# EAGLE design Grove - Barometer Sensor (BMP280) v1.0 (EAGLE 6.4)
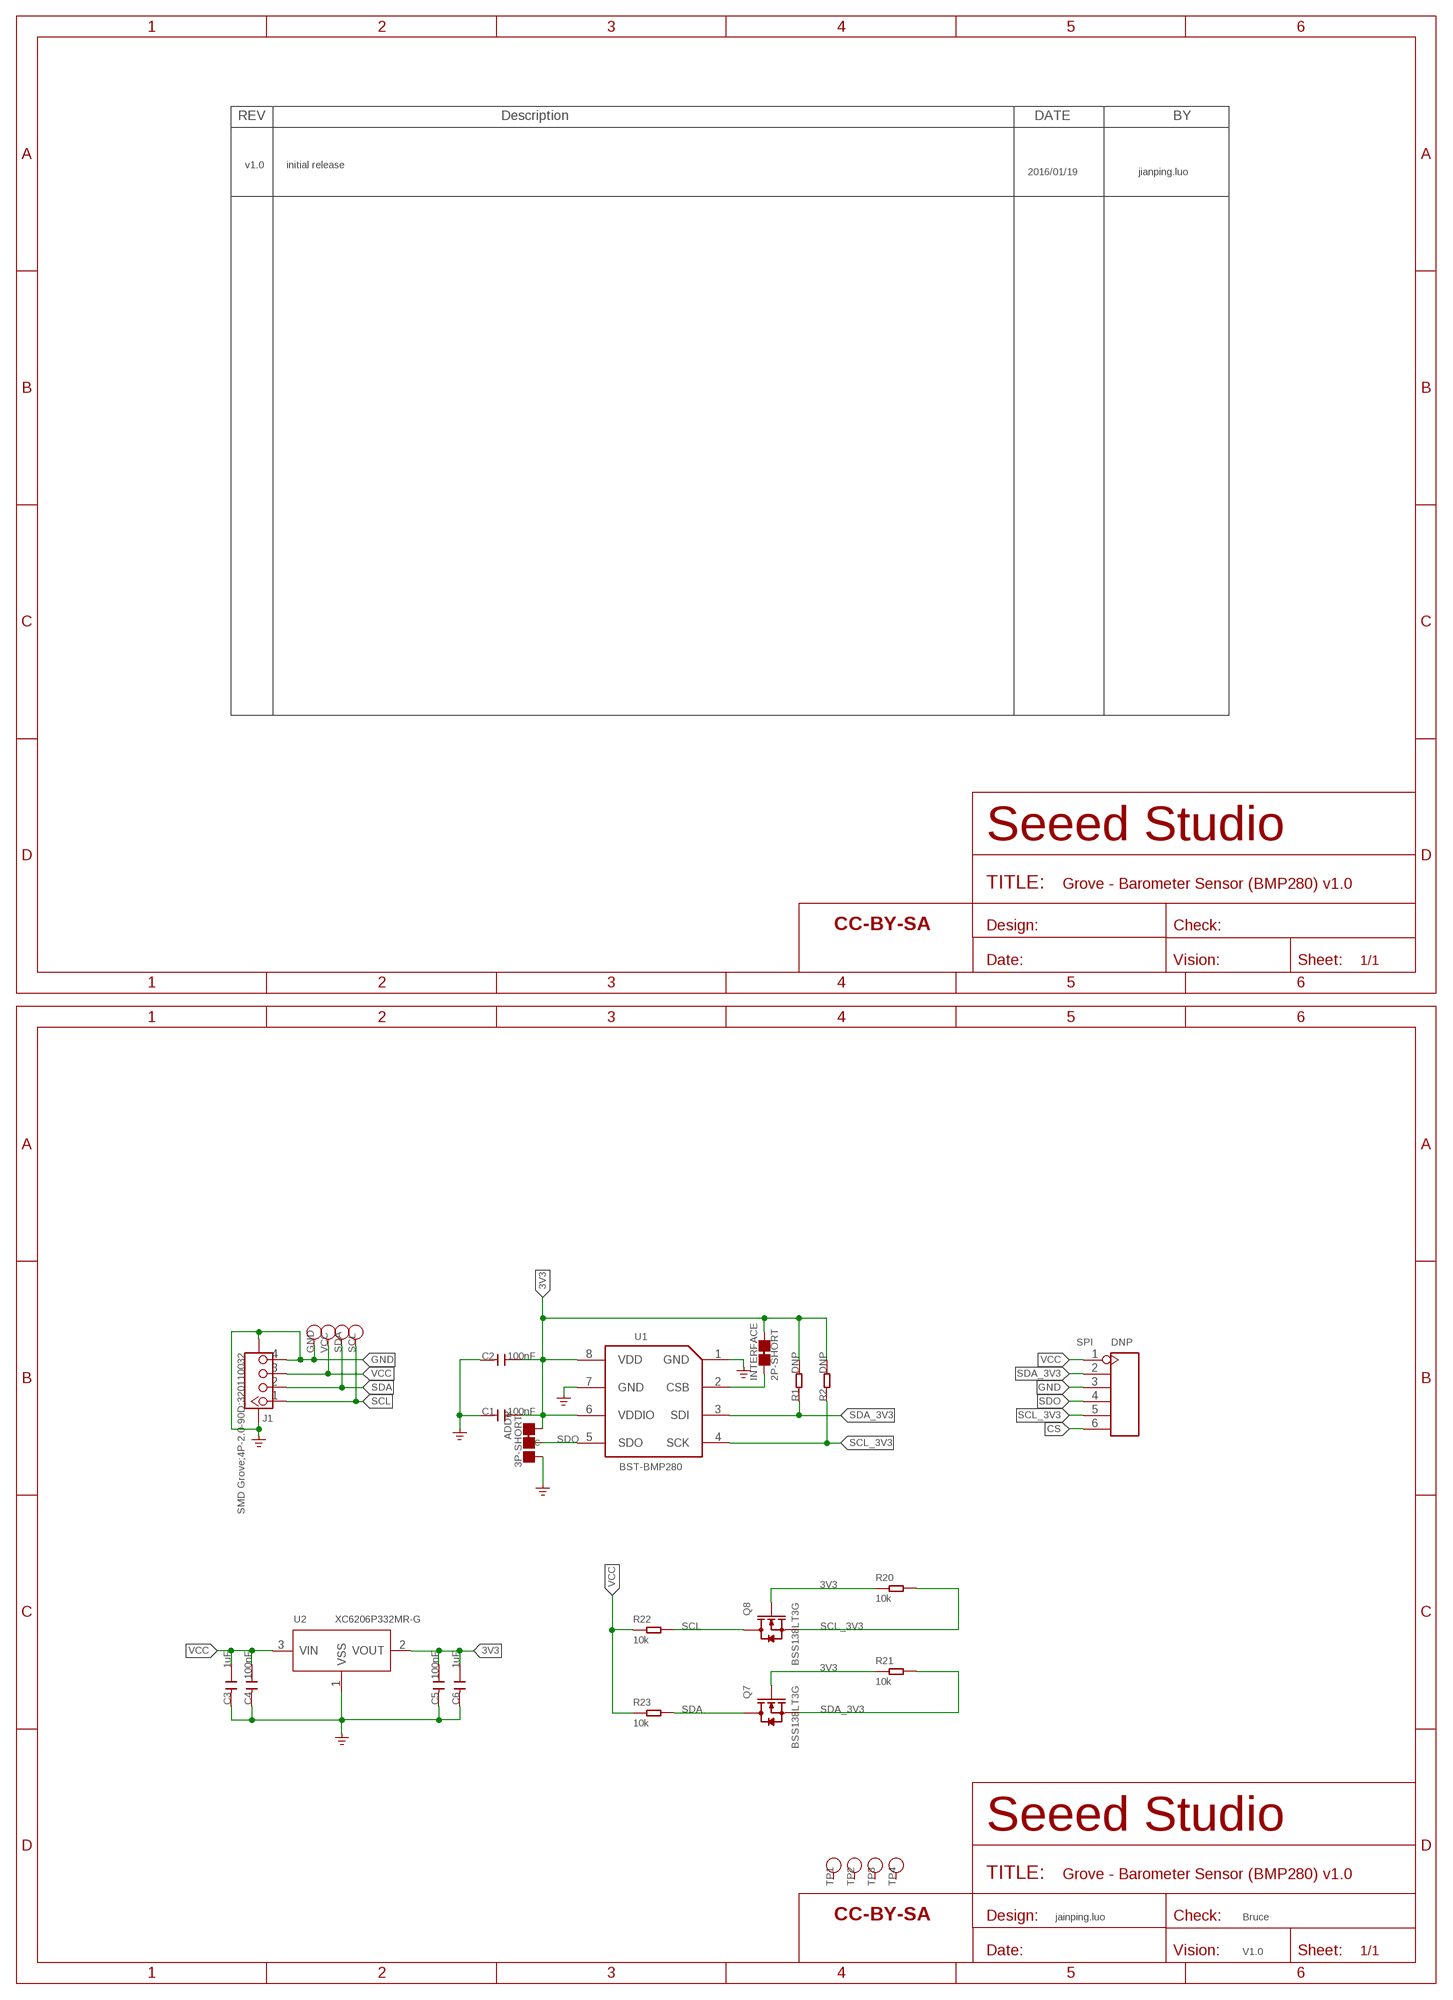
[diagram p0: schematic, sheet 1]

## Parts
ADDR  3P-SHORT  JUMPER-3P-SHORT  [3P-SMD-SHORT]
C1  100nF  CAP-0603  [C0603]
C2  100nF  CAP-0603  [C0603]
C3  1uF  CAP-0603  [C0603]
C4  100nF  CAP-0603  [C0603]
C5  100nF  CAP-0603  [C0603]
C6  1uF  CAP-0603  [C0603]
FR1  SEEEDSTUDIO-OPEN-SCH-FRAME  [SEEEDSTUDIO-PCB-FRAME]
FR2  SEEEDSTUDIO-OPEN-SCH-FRAME  [SEEEDSTUDIO-PCB-FRAME]
GND  TEST-POINT'4545'  [TP-D45MIL]
INTERFACE  2P-SHORT  JUMPER-2P-SHORT  [2P-SMD-SHORT]
J1  SMD Grove;4P-2.0-90D;320110032  GROVE-CONNECTOR-SMD'90D'  [HW4-SMD-2.0-90D]
Q7  BSS138LT3G  MOSFET-N'SOT23'  [SOT-23]
Q8  BSS138LT3G  MOSFET-N'SOT23'  [SOT-23]
R1  DNP  RES-0603  [R0603]
R2  DNP  RES-0603  [R0603]
R20  10k  RES-0603  [R0603]
R21  10k  RES-0603  [R0603]
R22  10k  RES-0603  [R0603]
R23  10k  RES-0603  [R0603]
SCL  TEST-POINT'4545'  [TP-D45MIL]
SDA  TEST-POINT'4545'  [TP-D45MIL]
SPI  DNP  HEADER-6P-65/35MIL  [H6-2.54-C65D35MIL]
TP1  TEST-POINT'4545'  [TP-D45MIL]
TP2  TEST-POINT'4545'  [TP-D45MIL]
TP3  TEST-POINT'4545'  [TP-D45MIL]
TP4  TEST-POINT'4545'  [TP-D45MIL]
U1  BST-BMP280  SENSOR-BMP280  [LGA8-0.65-2X2.5X0.95MM]
U2  XC6206P332MR-G  PMIC-XC6206PMR  [SOT-23]
VCC  TEST-POINT'4545'  [TP-D45MIL]

## Nets
3V3: ADDR.11(L) C1.1 C2.1 C5.1 C6.1 INTERFACE.2 Q7.1(G) Q8.1(G) R1.2 R2.2 R20.1 R21.1 U1.6(VDDIO) U1.8(VDD) U2.2(VOUT)
CS: INTERFACE.1 SPI.6 U1.2(CSB)
GND: ADDR.00(R) C1.2 C2.2 C3.2 C4.2 C5.2 C6.2 GND.T J1.4 J1.SS1 J1.SS2 SPI.3 U1.1(GND) U1.7(GND) U2.1(VSS) ; supply symbol labelled GND_POWER
SCL: J1.1 Q8.3(D) R22.2 SCL.T
SCL_3V3: Q8.2(S) R2.1 R20.2 SPI.5 U1.4(SCK)
SDA: J1.2 Q7.3(D) R23.2 SDA.T
SDA_3V3: Q7.2(S) R1.1 R21.2 SPI.2 U1.3(SDI)
SDO: ADDR.MM(C) SPI.4 U1.5(SDO)
VCC: C3.1 C4.1 J1.3 R22.1 R23.1 SPI.1 U2.3(VIN) VCC.T
Unconnected: TP1.T TP2.T TP3.T TP4.T

## Notes on the sheet
- v1.0 | initial release
- 2016/01/19 | jianping.luo
- jainping.luo | Bruce
- V1.0

## Library data of the parts
ADDR = Discrete-new:JUMPER-3P-SHORT
C1-C6 = Discrete-new:CAP: Ceramic Capacitors
FR1 FR2 = moudle-new:SEEEDSTUDIO-OPEN-SCH-FRAME
GND SCL SDA TP1-TP4 VCC = Discrete-new:TEST-POINT; PARTNO: DNP
INTERFACE = Discrete-new:JUMPER-2P-SHORT
J1 = Connector-new:GROVE-CONNECTOR-SMD: 4P-SMD-2.0:320110030;4P-SMD-2.0-90D:320110032
Q7 Q8 = Discrete-new:MOSFET-N
R1 R2 R20-R23 = Discrete-new:RES
SPI = Connector-new:HEADER-6P
U1 = template:SENSOR-BMP280: Digital Pressure Sensor; MPN: BMP280
U2 = IC-new:PMIC-XC6206P: LOW ESR Cap.Compatible Positive Voltage Regulators

## Board
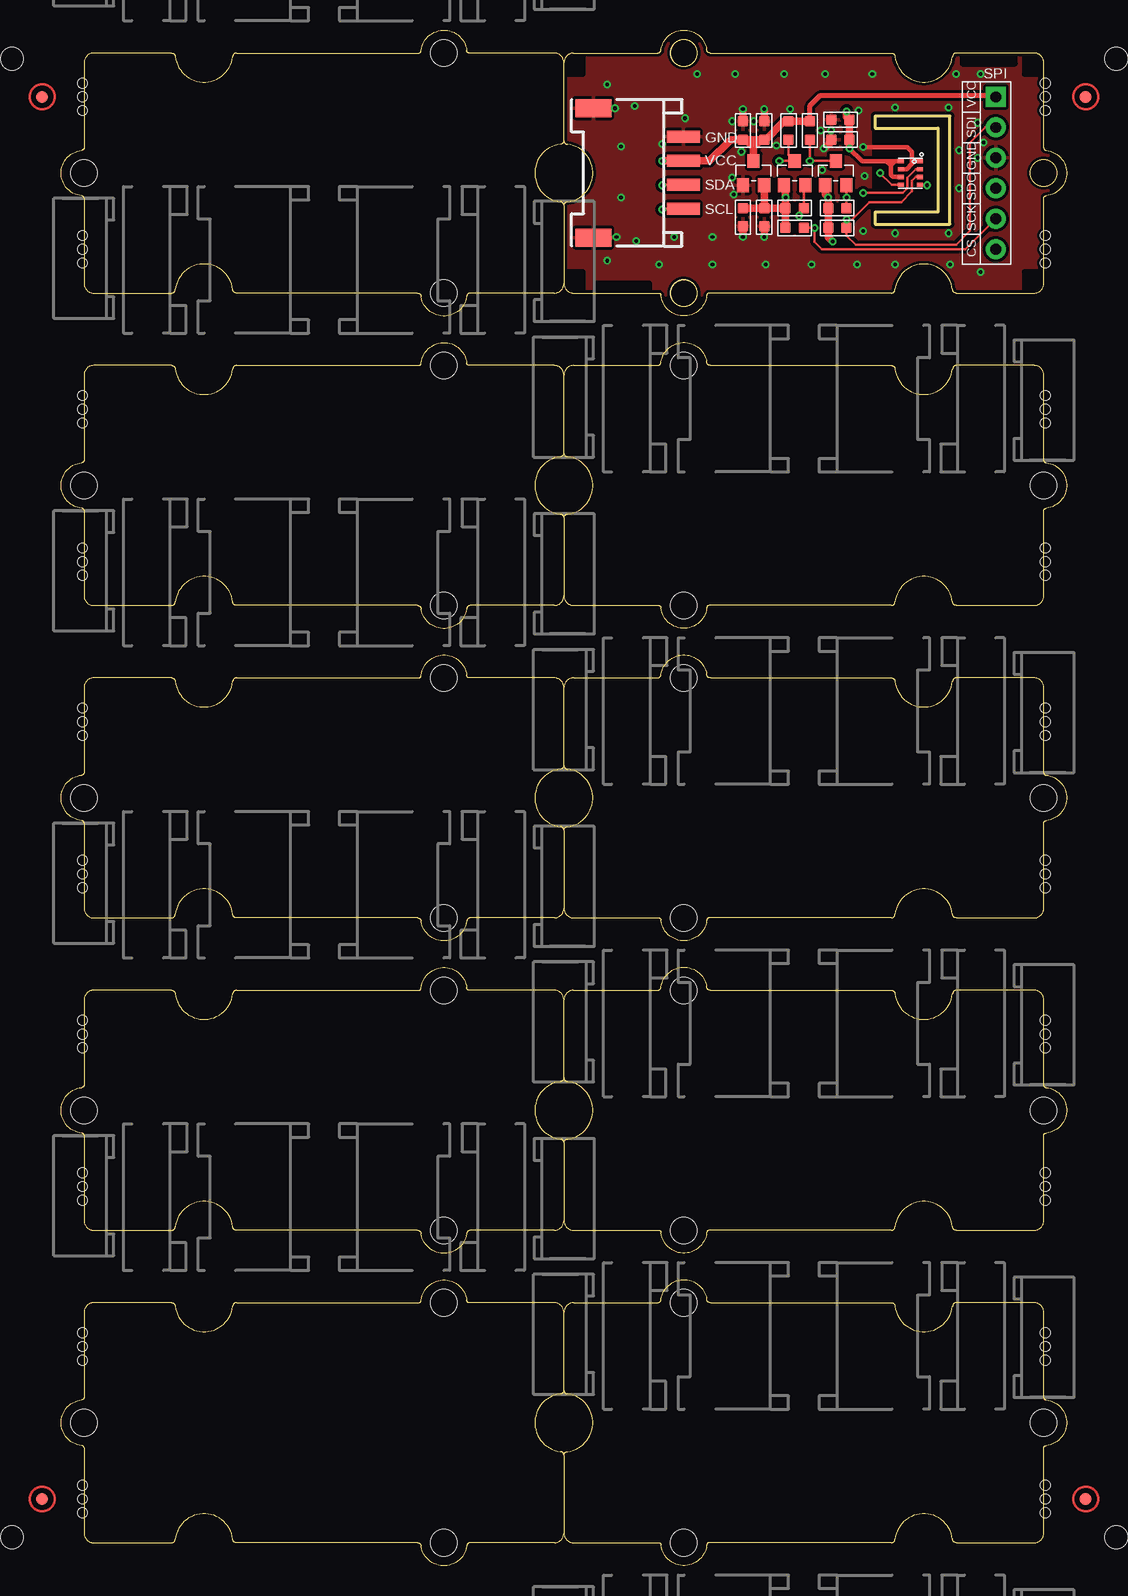
[diagram p1: board, top side]
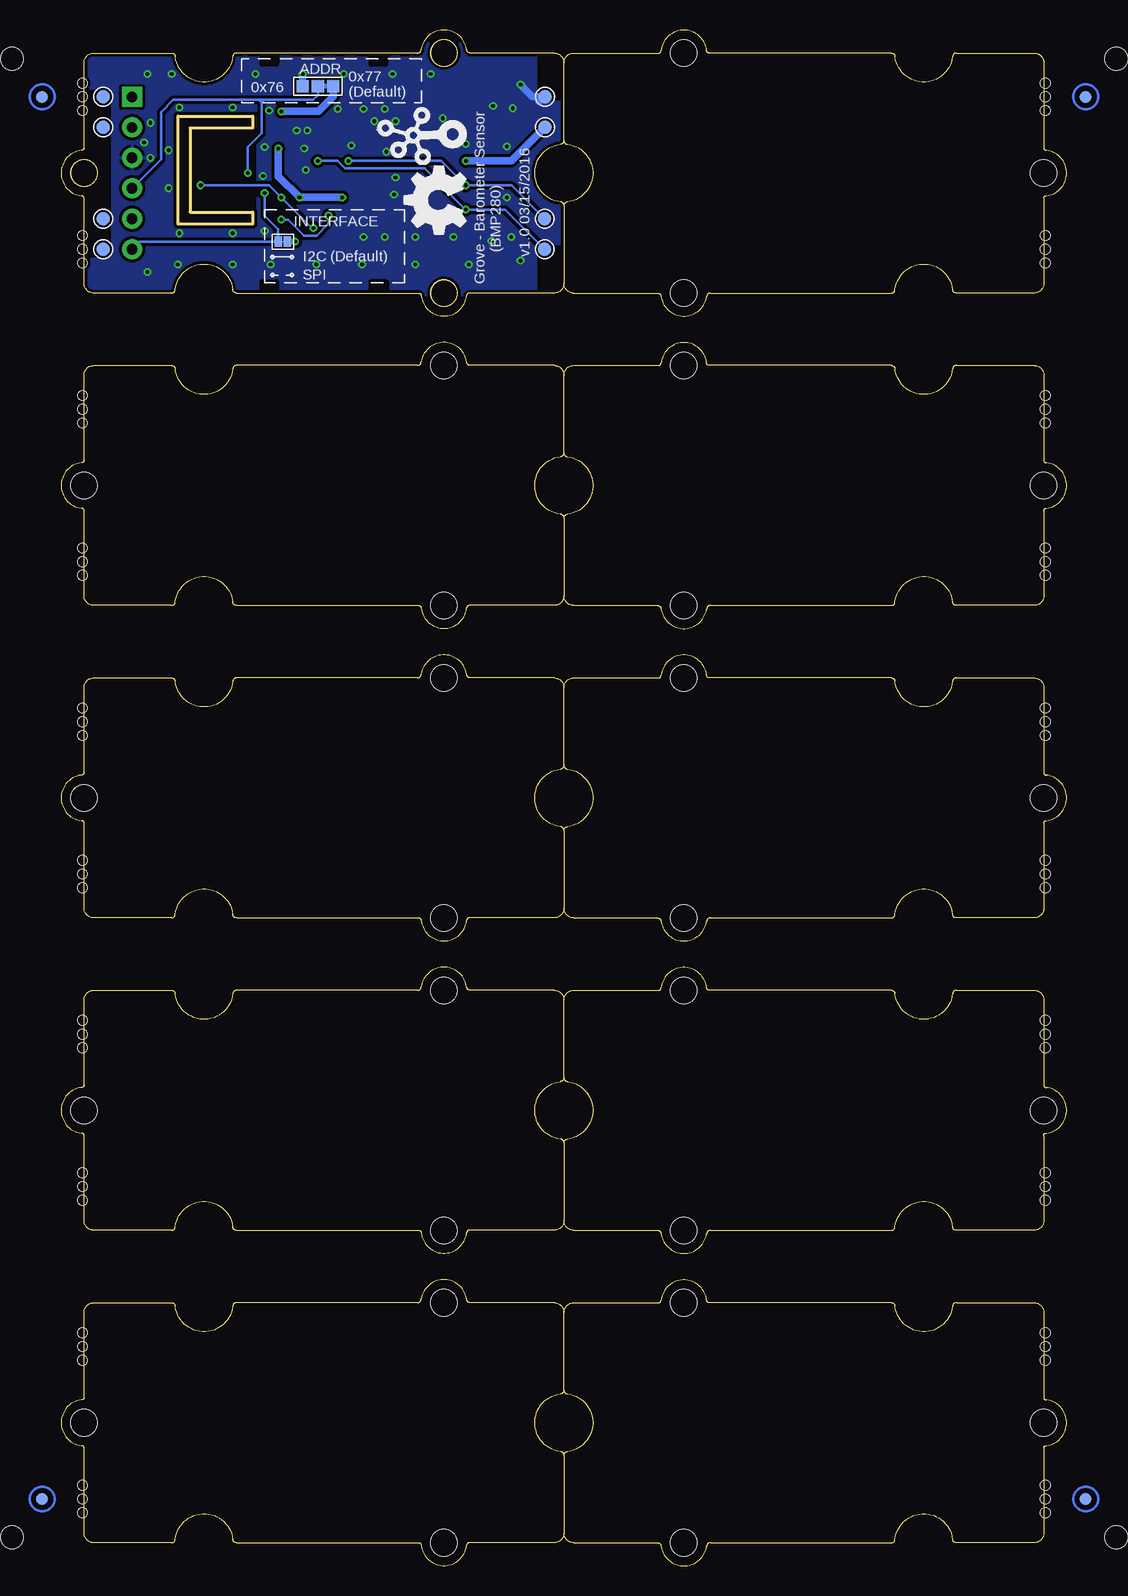
[diagram p2: board, bottom side, seen from below]

Size 83.82 x 127.98 mm. Coordinates in mm from the lower left corner, seen from the top.
Outline: 67.85,119.82 73.09,119.82 73.09,112.82 67.85,112.82 67.85,111.82 74.09,111.82 74.09,120.82 67.85,120.82 67.85,119.82
Copper layers (1*16): Top 0.035mm / dielectric 1.5mm / Bottom 0.035mm
Design rules "SeeedStudio_2layer_DRU_no_angle_20140221 *": minimum track width 6mil, minimum drill 12mil, track to track 6mil, track to pad 6mil, pad to pad 6mil, via to via 6mil, smd to smd 0mil, copper to edge 10mil, drill to drill 10mil, minimum pad ring 10mil, minimum via ring 6mil, stop-mask expansion 2mil, vias tented up to drill 25mil, thermal gap 10mil
Holes 0.8 mm at 1.78,123.55 1.78,121.27 1.78,122.41 1.78,110.85 1.78,108.57 1.78,109.71 1.78,97.52 1.78,95.23 1.78,96.38 1.78,84.82 1.78,82.53 1.78,83.68 1.78,71.48 1.78,69.2 1.78,70.34 1.78,58.78 1.78,56.5 1.78,57.64 1.78,45.45 1.78,43.16 1.78,44.31 1.78,32.75 1.78,30.46 1.78,31.61 1.78,19.41 1.78,17.13 1.78,18.27 1.78,6.71 1.78,4.43 1.78,5.57 82.04,121.27 82.04,123.55 82.04,122.41 82.04,108.57 82.04,110.85 82.04,109.71 82.04,95.23 82.04,97.52 82.04,96.38 82.04,82.53 82.04,84.82 82.04,83.68 82.04,69.2 82.04,71.48 82.04,70.34 82.04,56.5 82.04,58.78 82.04,57.64 82.04,43.16 82.04,45.45 82.04,44.31 82.04,30.46 82.04,32.75 82.04,31.61 82.04,17.13 82.04,19.41 82.04,18.27 82.04,4.43 82.04,6.71 82.04,5.57
Holes 1.91 mm at -4.13,2.4 87.95,2.4 87.95,125.59 -4.13,125.59
tRestrict: area 67.8,111.7 to 74.2,120.9
bRestrict: area 67.8,111.7 to 74.2,120.9

### Footprints (pad centres in the part's own frame; a part is rotated, then mirrored left to right if it is on the bottom)
3P-SMD-SHORT = smd 1.016 x 1.016: 00 -1.27,0; 11 1.27,0; MM 0,0
C0603 = smd 0.889 x 0.889: 1 0,0.762; 2 0,-0.762
TP-D45MIL = smd 1.143 x 1.143: T 0,0
2P-SMD-SHORT = smd 0.889 x 0.61: 1 0,0.381; 2 0,-0.381
HW4-SMD-2.0-90D = smd 1.01 x 2.74: 1 -3,-0.1; 2 -1,-0.1; 3 1,-0.1; 4 3,-0.1 | smd 1.5 x 3: SS1 -5.4,7.4; SS2 5.4,7.4
ROUND-MARK-1.0 = smd 1.016 x 1.016: P$1 0,0
SOT-23 = smd 1.016 x 1.143: 1 -0.889,-1.016; 2 0.889,-1.016; 3 0,1.016
R0603 = smd 0.889 x 0.889: 1 0,0.762; 2 0,-0.762
H6-2.54-C65D35MIL = drill 0.889 pad 1.651 square: 1 0,6.35 | drill 0.889 pad 1.651: 2 0,3.81; 3 0,1.27; 4 0,-1.27; 5 0,-3.81; 6 0,-6.35
LGA8-0.65-2X2.5X0.95MM = smd 0.5 x 0.35: 1 0.8,0.975; 2 0.8,0.325; 3 0.8,-0.325; 4 0.8,-0.975; 5 -0.8,-0.975; 6 -0.8,-0.325; 7 -0.8,0.325; 8 -0.8,0.975
GROVE-TEST-PLATFORM = hole 2.2: -10,-10; -10,10; 20,0
GROVE-1*2-TEST-PLATFORM = hole 2.2: 10.635,10; 10.635,-10; -19.365,0

### Placement (x,y rotation side)
ADDR  62.42,123.3 0 bottom
C1  64.96,118.86 270 top
C2  64.96,120.51 270 top
C3  56.83,119.62 180 top
C4  58.61,119.62 180 top
C5  56.83,112.38 0 top
C6  58.61,112.38 0 top
FR1  94.93,112.38 0 top  (outside the outline)
FR2  186.63,-21.48 0 bottom  (outside the outline)
GND  43.5,122.41 90 bottom
INTERFACE  65.34,110.35 90 bottom
J1  51.76,116.07 90 top
P1  [ROUND-MARK-1.0]  -1.59,5.57 0 top
P2  [ROUND-MARK-1.0]  85.41,5.57 0 top
P3  [ROUND-MARK-1.0]  -1.59,122.41 0 top
P4  [ROUND-MARK-1.0]  85.41,122.41 0 top
P5  [ROUND-MARK-1.0]  -1.59,5.57 0 bottom
P6  [ROUND-MARK-1.0]  85.41,5.57 0 bottom
P7  [ROUND-MARK-1.0]  85.41,122.41 0 bottom
P8  [ROUND-MARK-1.0]  -1.59,122.41 0 bottom
Q7  61.15,116.06 0 top
Q8  64.58,116.06 0 top
R1  64.71,111.49 270 top
R2  61.15,111.49 270 top
R20  64.71,113.14 90 top
R21  61.15,113.14 90 top
R22  62.42,119.62 0 top
R23  60.64,119.62 0 top
SCL  43.51,109.72 90 bottom
SDA  43.51,112.26 90 bottom
SPI  77.92,116.06 0 top
TP1  80.33,122.41 0 bottom
TP2  80.33,119.87 0 bottom
TP3  80.33,112.25 0 bottom
TP4  80.33,109.71 0 bottom
U1  70.8,116.06 0 top
U2  57.72,116.06 0 top
U3  [GROVE-TEST-PLATFORM]  61.91,37.96 0 top
U4  [GROVE-TEST-PLATFORM]  21.91,37.96 180 top
U5  [GROVE-TEST-PLATFORM]  61.91,63.99 0 top
U6  [GROVE-TEST-PLATFORM]  21.91,63.99 180 top
U7  [GROVE-TEST-PLATFORM]  61.91,90.03 0 top
U8  [GROVE-TEST-PLATFORM]  21.91,90.03 180 top
U9  [GROVE-TEST-PLATFORM]  21.91,116.06 180 top
U10  [GROVE-TEST-PLATFORM]  61.91,116.06 0 top
U11  [GROVE-TEST-PLATFORM]  61.91,11.92 0 top
U12  [GROVE-TEST-PLATFORM]  21.91,11.92 180 top
U$3  [OSHW_FILLX200_NOTEXT]  50.1,110.98 90 bottom
U$4  [TWIGLOGO]  50.99,119.24 90 bottom
U$8  [GROVE-1*2-TEST-PLATFORM]  62.55,116.06 180 top
VCC  43.5,119.87 90 bottom

### Tracks (layer width: path | path; a pad name or v marks a point on that pad's centre or on a via)
3V3  (via drill 0.3 pad 0.64)
  Top 0.356: U1.8 69.49,117.04 | 69.49,117.04 69.15,117.04 | 69.15,117.04 68.81,117.04 | 68.81,117.04 66.78,117.04 v65.72,118.09 | U1.6 69.35,115.74 69.15,115.93 69.15,116.7 | 69.15,116.7 69.15,117.04 | 68.81,117.04 69.15,116.7 | 69.49,117.04 69.15,116.7
  Top 0.61: U2.2 C6.1 | C5.1 C6.1 | C6.1 R21.1 | R21.1 v60.39,114.03 60.39,114.92 Q7.1 | R2.2 R21.1 | Q8.1 63.69,114.28 v63.95,114.03 R20.1 R1.2 63.95,110.73 v64.33,110.35 | v65.72,118.09 C1.1 C2.1 65.47,120.76 v65.47,121.21
  Bottom 0.406: INTERFACE.2 v64.33,110.35
  Bottom 0.61: v60.39,114.03 v63.95,114.03 65.72,115.81 v65.72,118.09 | ADDR.11 61.15,122.41 62.36,121.21 v65.47,121.21
CS  (via drill 0.3 pad 0.64)
  Top 0.203: U1.2 71.26,116.39 70.55,115.68 70.55,114.79 70.17,114.41 v66.87,114.41
  Bottom 0.203: SPI.6 77.28,110.35 INTERFACE.1 65.72,111.36 66.87,112.51 v66.87,114.41
GND  (via drill 0.3 pad 0.64)
  Top 0.356: U1.7 70.49,116.39 70.93,116.82 | 70.93,116.82 71.14,117.04 U1.1 | 70.93,116.82 70.93,117.84 70.55,118.22 v66.87,118.22
  Top 0.61: C4.2 v58.61,121.4 | C3.2 v56.83,121.4 | C1.2 64.2,118.73 v63.56,118.09 | C6.2 v58.61,110.73 | C5.2 v56.83,110.73
  Bottom 0.61: v45.53,123.43 44.51,122.41 GND.T 43.63,122.41 44.01,122.03 | ADDR.00 v63.69,124.32
  other vias: 47.82,121.65 46.17,121.46 45.53,108.76 47.94,110.41 46.67,118.28 50.1,118.47 46.29,110.73 46.67,114.03 56.07,114.28 66.49,121.27 55.94,120.38 57.72,120.38 54.29,110.73 51.12,110.73 54.29,108.44 58.74,108.44 62.55,108.44 66.36,108.44 52.01,120.63 60.26,124.32 56.2,124.32 53.02,124.32 67.63,124.32 74.61,124.32 76.65,124.32 76.9,118.6 76.39,120.25 76.39,117.33 69.53,108.44 74.11,108.44 76.65,107.81 49.85,108.44 63.31,119.62 64.2,119.62 66.99,115.81 63.44,116.32 55.94,115.68 59.63,118.35 56.71,117.84 60.77,121.4 66.87,111.24 69.53,111.04 73.98,111.04 69.53,121.52 73.98,121.52 74.87,114.79 74.87,117.97
  pour Top (isolate 0.254): 41.59,126.86 82.23,126.86 82.23,105.9 41.59,105.9
  pour Bottom (isolate 0.254): 41.59,126.86 82.23,126.86 82.23,105.9 41.59,105.9
SCL  (via drill 0.3 pad 0.64)
  Top 0.203: J1.1 50.16,113.07 v50.1,113.01 | Q8.3 v62.42,117.08 R22.2
  Bottom 0.203: SCL.T 46.81,113.01 v50.1,113.01 53.53,116.44 60.14,116.44 60.77,117.08 v62.42,117.08
SCL_3V3  (via drill 0.3 pad 0.64)
  Top 0.203: R20.2 v65.47,114.03 Q8.2 | R2.1 v62.8,111.49 62.8,110.35 63.44,109.71 75.38,109.71 SPI.5 | U1.4 72.16,115.09 v72.2,115.05
  Bottom 0.203: v62.8,111.49 62.93,111.49 v65.47,114.03 66.49,115.05 v72.2,115.05
SDA  (via drill 0.3 pad 0.64)
  Top 0.203: J1.2 50.13,115.07 v50.1,115.05 | R23.2 60.64,117.59 Q7.3 v59.88,117.08
  Bottom 0.203: SDA.T 46.3,115.05 v50.1,115.05 52.13,117.08 v59.88,117.08
SDA_3V3  (via drill 0.3 pad 0.64)
  Top 0.203: Q7.2 61.91,114.92 R21.2 61.53,112.76 v61.53,112.51 | U1.3 71.24,115.74 70.93,115.43 70.93,114.54 70.04,113.65 67.37,113.65 65.91,112.19 v65.47,112.19 R1.1 65.47,110.85 66.23,110.09 74.61,110.09 75.76,111.24 75.76,118.6 77.03,119.87 SPI.2
  Bottom 0.203: v65.47,112.19 64.9,112.19 63.56,110.85 62.55,110.85 61.53,111.87 v61.53,112.51
SDO  (via drill 0.3 pad 0.64)
  Top 0.203: U1.5 69.24,115.09 v68.26,116.06
  Bottom 0.203: ADDR.MM 62.42,122.54 62.8,122.16 66.87,122.16 | SPI.4 75.5,117.2 75.5,121.14 74.49,122.16 67.37,122.16 | 67.37,122.16 67.12,122.16 | 67.12,122.16 66.87,122.16 | 67.12,121.9 67.12,119.36 68.26,118.22 v68.26,116.06 | 67.12,121.9 67.12,122.16 | 67.12,121.9 66.87,122.16 | 67.12,121.9 67.37,122.16
VCC  (via drill 0.3 pad 0.64)
  Top 0.406: R22.1 62.42,121.65 63.31,122.54 77.79,122.54 SPI.1
  Top 0.61: v50.1,117.08 v50.11,117.07 J1.3 54.03,117.07 55.82,118.86 C3.1 57.72,118.86 | 57.72,118.86 C4.1 | U2.3 57.72,118.22 | 57.72,118.22 57.72,118.86 | 57.72,118.22 57.21,118.73 | 57.72,118.22 58.23,118.73 58.61,118.73 60.26,120.38 R23.1 R22.1
  Bottom 0.61: VCC.T 46.29,117.08 v50.1,117.08

### Text on the board
tPlace: VCC | GND | SDI | VCC | GND | SDA | SDO | SCL | SCK | CS
bPlace: 0x77 | 0x76 | (Default) | v1.0 03/15/2016 | (Default) | I2C | Grove - Barometer Sensor / (BMP280) | SPI